# Altium project 数字时钟v2.PrjPcb
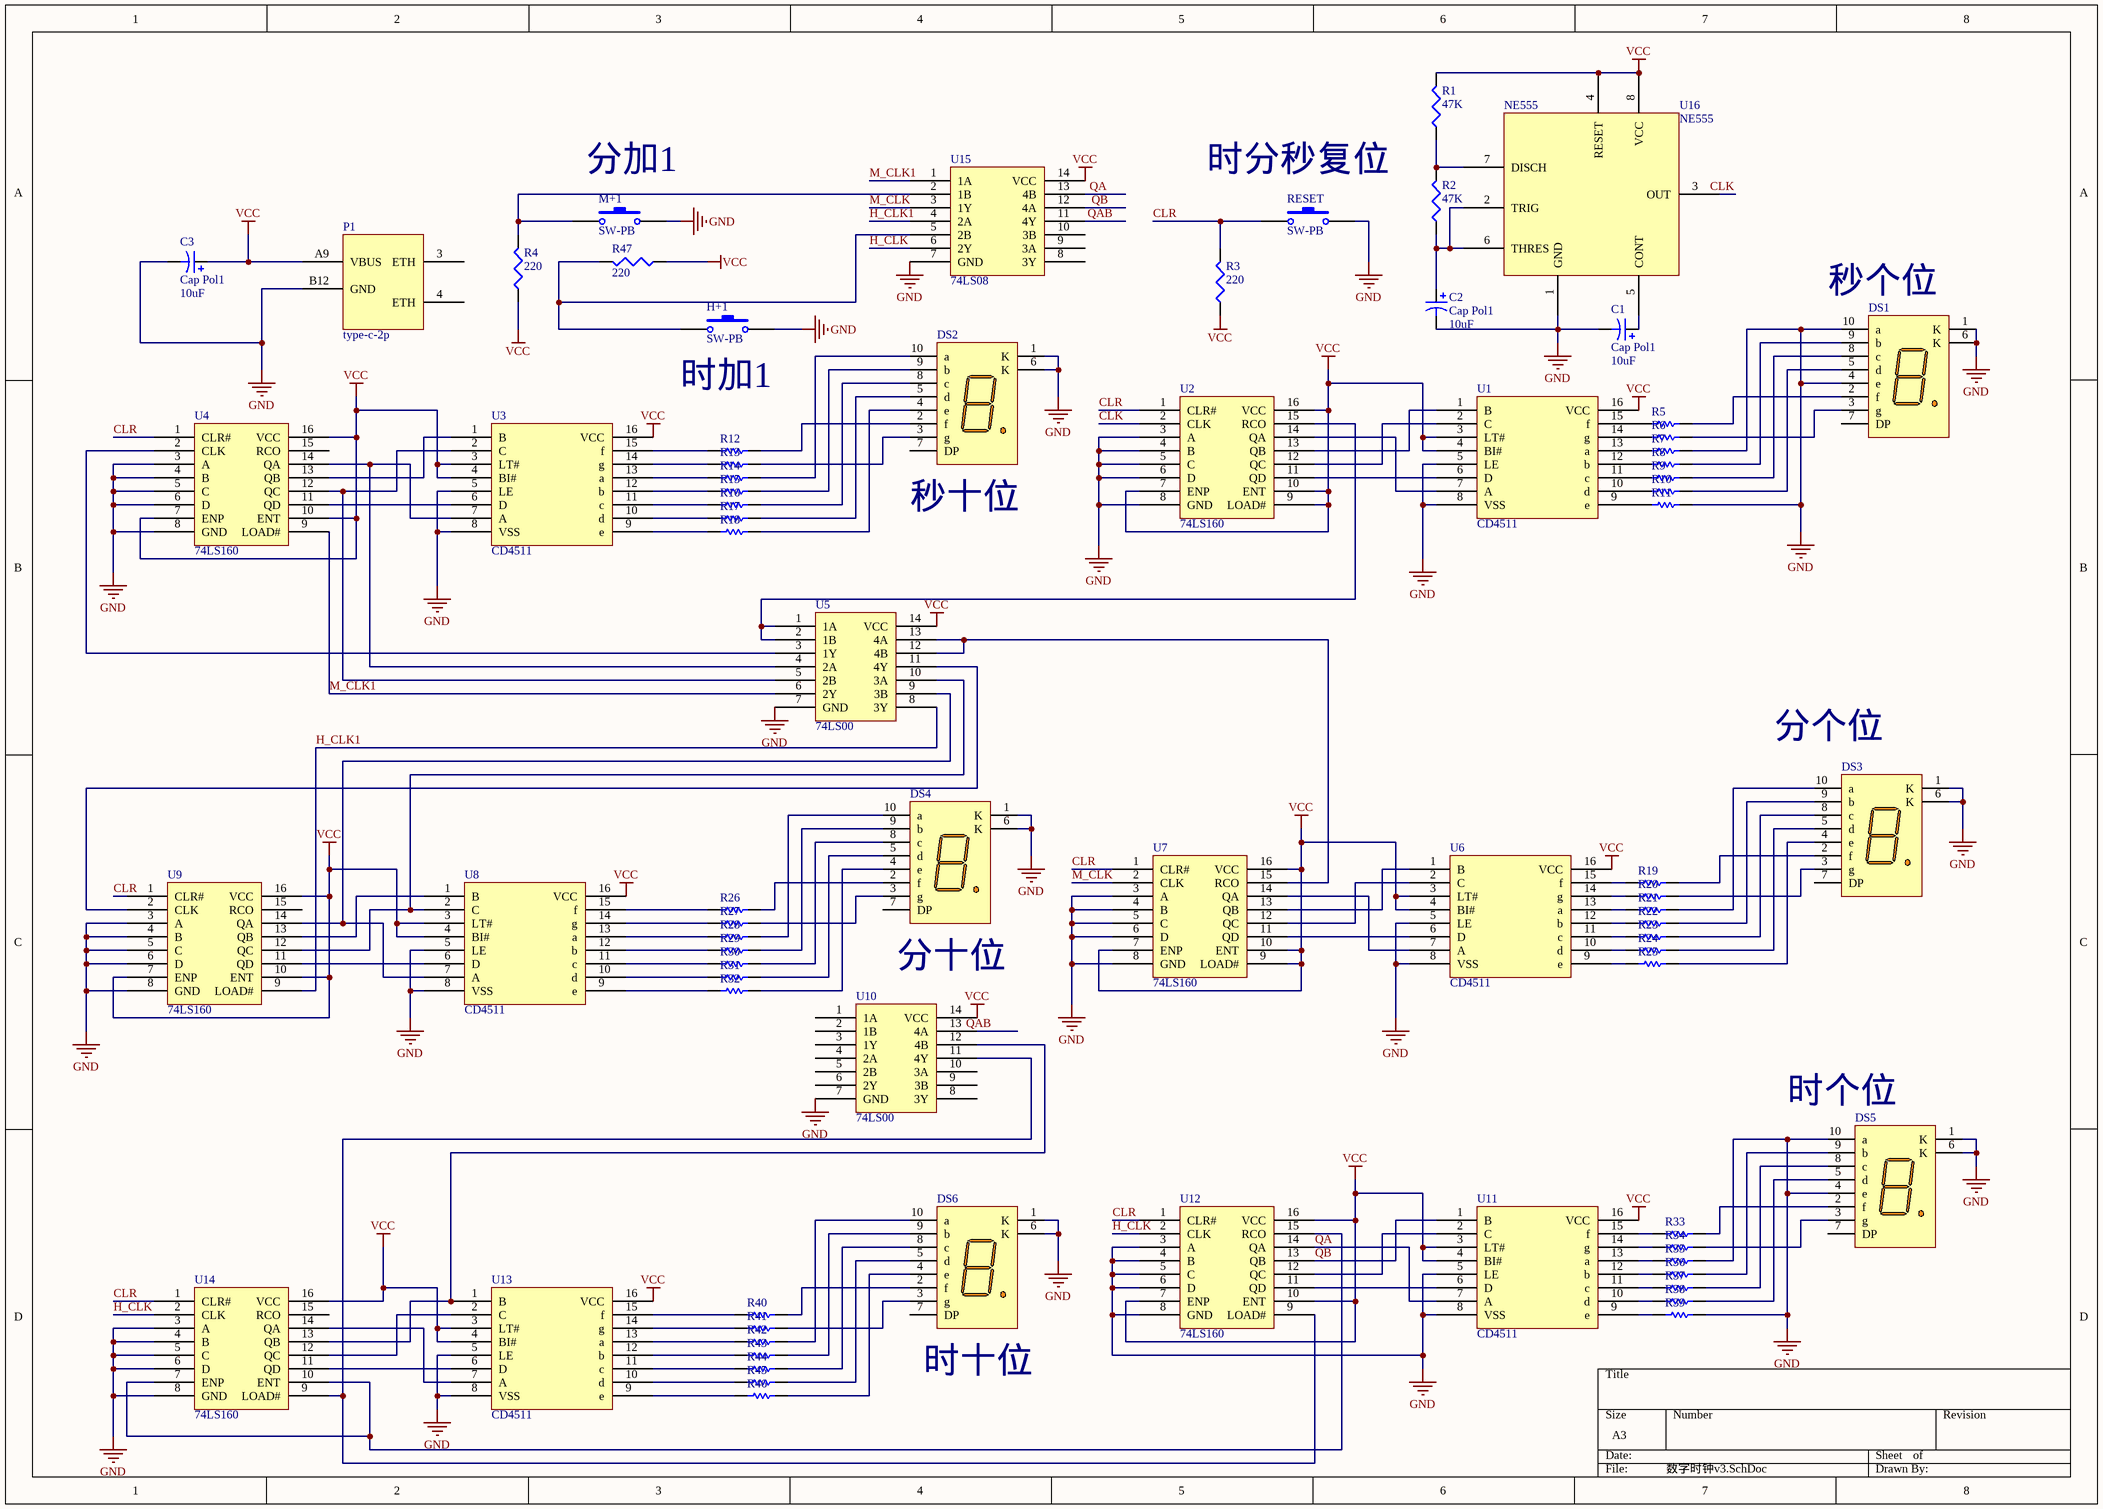
[diagram p0: 数字时钟v3.SchDoc]
1 sheet, 76 parts. Net scope: global (net labels, ports and power ports of the same name join across sheets).
Board file: 数字时钟v3.PcbDoc

## Sheet 数字时钟v3.SchDoc: 数字电路时钟
size A3; DrawnBy: zhanweiming

### Parts
C1  Cap Pol1  value 10uF  [电容]
C2  Cap Pol1  value 10uF  [电容]
C3  Cap Pol1  value 10uF  [电容]
DS1  Dpy Amber-CC  [A]  (value not drawn)
DS2  Dpy Amber-CC  [A]  (value not drawn)
DS3  Dpy Amber-CC  [A]  (value not drawn)
DS4  Dpy Amber-CC  [A]  (value not drawn)
DS5  Dpy Amber-CC  [A]  (value not drawn)
DS6  Dpy Amber-CC  [A]  (value not drawn)
H+1  SW-PB  [按键]
M+1  SW-PB  [按键]
P1  type-c-2p  [type-c-2p]
R1  value 47K  [AXIAL-0.3]  (hidden comment: Res3)
R2  value 47K  [AXIAL-0.3]  (hidden comment: Res3)
R3  value 220  [AXIAL-0.3]  (hidden comment: Res3)
R4  value 220  [AXIAL-0.3]  (hidden comment: Res3)
R5  Res1  [AXIAL-0.3]  (value not drawn)
R6  Res1  [AXIAL-0.3]  (value not drawn)
R7  Res1  [AXIAL-0.3]  (value not drawn)
R8  Res1  [AXIAL-0.3]  (value not drawn)
R9  Res1  [AXIAL-0.3]  (value not drawn)
R10  Res1  [AXIAL-0.3]  (value not drawn)
R11  Res1  [AXIAL-0.3]  (value not drawn)
R12  Res1  [AXIAL-0.3]  (value not drawn)
R13  Res1  [AXIAL-0.3]  (value not drawn)
R14  Res1  [AXIAL-0.3]  (value not drawn)
R15  Res1  [AXIAL-0.3]  (value not drawn)
R16  Res1  [AXIAL-0.3]  (value not drawn)
R17  Res1  [AXIAL-0.3]  (value not drawn)
R18  Res1  [AXIAL-0.3]  (value not drawn)
R19  Res1  [AXIAL-0.3]  (value not drawn)
R20  Res1  [AXIAL-0.3]  (value not drawn)
R21  Res1  [AXIAL-0.3]  (value not drawn)
R22  Res1  [AXIAL-0.3]  (value not drawn)
R23  Res1  [AXIAL-0.3]  (value not drawn)
R24  Res1  [AXIAL-0.3]  (value not drawn)
R25  Res1  [AXIAL-0.3]  (value not drawn)
R26  Res1  [AXIAL-0.3]  (value not drawn)
R27  Res1  [AXIAL-0.3]  (value not drawn)
R28  Res1  [AXIAL-0.3]  (value not drawn)
R29  Res1  [AXIAL-0.3]  (value not drawn)
R30  Res1  [AXIAL-0.3]  (value not drawn)
R31  Res1  [AXIAL-0.3]  (value not drawn)
R32  Res1  [AXIAL-0.3]  (value not drawn)
R33  Res1  [AXIAL-0.3]  (value not drawn)
R34  Res1  [AXIAL-0.3]  (value not drawn)
R35  Res1  [AXIAL-0.3]  (value not drawn)
R36  Res1  [AXIAL-0.3]  (value not drawn)
R37  Res1  [AXIAL-0.3]  (value not drawn)
R38  Res1  [AXIAL-0.3]  (value not drawn)
R39  Res1  [AXIAL-0.3]  (value not drawn)
R40  Res1  [AXIAL-0.3]  (value not drawn)
R41  Res1  [AXIAL-0.3]  (value not drawn)
R42  Res1  [AXIAL-0.3]  (value not drawn)
R43  Res1  [AXIAL-0.3]  (value not drawn)
R44  Res1  [AXIAL-0.3]  (value not drawn)
R45  Res1  [AXIAL-0.3]  (value not drawn)
R46  Res1  [AXIAL-0.3]  (value not drawn)
R47  value 220  [AXIAL-0.3]  (hidden comment: Res3)
RESET  SW-PB  [按键]
U1  CD4511  [CD4511BM/TR]
U2  74LS160  [DIP-16]
U3  CD4511  [CD4511BM/TR]
U4  74LS160  [DIP-16]
U5  74LS00  [DIP-14]
U6  CD4511  [CD4511BM/TR]
U7  74LS160  [DIP-16]
U8  CD4511  [CD4511BM/TR]
U9  74LS160  [DIP-16]
U10  74LS00  [DIP-14]
U11  CD4511  [CD4511BM/TR]
U12  74LS160  [DIP-16]
U13  CD4511  [CD4511BM/TR]
U14  74LS160  [DIP-16]
U15  74LS08  [DIP-14]
U16  NE555  [DIP-8]

### Nets
GND: C1.2 C2.2 C3.2 DS1.1(K) DS1.4(e) DS1.6(K) DS1.10(a) DS2.1(K) DS2.6(K) DS3.1(K) DS3.6(K) DS4.1(K) DS4.6(K) DS5.1(K) DS5.4(e) DS5.6(K) DS5.10(a) DS6.1(K) DS6.6(K) H+1.2 M+1.2 P1.B12(GND) R7.2 R11.2 R35.2 R39.2 RESET.2 U1.5(LE) U1.8(VSS) U2.3(A) U2.4(B) U2.5(C) U2.6(D) U2.8(GND) U3.5(LE) U3.8(VSS) U4.3(A) U4.4(B) U4.5(C) U4.6(D) U4.8(GND) U5.7(GND) U6.5(LE) U6.8(VSS) U7.3(A) U7.4(B) U7.5(C) U7.6(D) U7.8(GND) U8.5(LE) U8.8(VSS) U9.3(A) U9.4(B) U9.5(C) U9.6(D) U9.8(GND) U10.7(GND) U11.5(LE) U11.8(VSS) U12.3(A) U12.4(B) U12.5(C) U12.6(D) U12.8(GND) U13.5(LE) U13.8(VSS) U14.3(A) U14.4(B) U14.5(C) U14.6(D) U14.8(GND) U15.7(GND) U16.1(GND)
VCC: C3.1 P1.A9(VBUS) R1.2 R3.1 R4.1 R47.1 U1.3(LT#) U1.4(BI#) U1.16(VCC) U2.7(ENP) U2.9(LOAD#) U2.10(ENT) U2.16(VCC) U3.3(LT#) U3.4(BI#) U3.16(VCC) U4.7(ENP) U4.10(ENT) U4.16(VCC) U5.14(VCC) U6.3(LT#) U6.4(BI#) U6.16(VCC) U7.7(ENP) U7.9(LOAD#) U7.10(ENT) U7.16(VCC) U8.3(LT#) U8.4(BI#) U8.16(VCC) U9.7(ENP) U9.10(ENT) U9.16(VCC) U10.14(VCC) U11.3(LT#) U11.4(BI#) U11.16(VCC) U12.7(ENP) U12.10(ENT) U12.16(VCC) U13.3(LT#) U13.4(BI#) U13.16(VCC) U14.16(VCC) U15.14(VCC) U16.4(RESET) U16.8(VCC)
CLK: U2.2(CLK) U16.3(OUT)
CLR: R3.2 RESET.1 U2.1(CLR#) U4.1(CLR#) U7.1(CLR#) U9.1(CLR#) U12.1(CLR#) U14.1(CLR#)
H_CLK: U12.2(CLK) U14.2(CLK) U15.6(2Y)
H_CLK1: U5.8(3Y) U9.9(LOAD#) U15.4(2A)
M_CLK: U7.2(CLK) U15.3(1Y)
M_CLK1: U4.9(LOAD#) U5.6(2Y) U15.1(1A)
QA: U11.7(A) U12.14(QA) U15.13(4B)
QAB: U10.13(4A) U15.11(4Y)
QB: U11.1(B) U12.13(QB) U15.12(4A)
NetC1_1: C1.1 U16.5(CONT)
NetC2_1: C2.1 R2.1 U16.2(TRIG) U16.6(THRES)
NetDS1_2: DS1.2(f) R5.2
NetDS1_3: DS1.3(g) R6.2
NetDS1_5: DS1.5(d) R10.2
NetDS1_8: DS1.8(c) R9.2
NetDS1_9: DS1.9(b) R8.2
NetDS2_2: DS2.2(f) R12.2
NetDS2_3: DS2.3(g) R13.2
NetDS2_4: DS2.4(e) R18.2
NetDS2_5: DS2.5(d) R17.2
NetDS2_8: DS2.8(c) R16.2
NetDS2_9: DS2.9(b) R15.2
NetDS2_10: DS2.10(a) R14.2
NetDS3_2: DS3.2(f) R19.2
NetDS3_3: DS3.3(g) R20.2
NetDS3_4: DS3.4(e) R25.2
NetDS3_5: DS3.5(d) R24.2
NetDS3_8: DS3.8(c) R23.2
NetDS3_9: DS3.9(b) R22.2
NetDS3_10: DS3.10(a) R21.2
NetDS4_2: DS4.2(f) R26.2
NetDS4_3: DS4.3(g) R27.2
NetDS4_4: DS4.4(e) R32.2
NetDS4_5: DS4.5(d) R31.2
NetDS4_8: DS4.8(c) R30.2
NetDS4_9: DS4.9(b) R29.2
NetDS4_10: DS4.10(a) R28.2
NetDS5_2: DS5.2(f) R33.2
NetDS5_3: DS5.3(g) R34.2
NetDS5_5: DS5.5(d) R38.2
NetDS5_8: DS5.8(c) R37.2
NetDS5_9: DS5.9(b) R36.2
NetDS6_2: DS6.2(f) R40.2
NetDS6_3: DS6.3(g) R41.2
NetDS6_4: DS6.4(e) R46.2
NetDS6_5: DS6.5(d) R45.2
NetDS6_8: DS6.8(c) R44.2
NetDS6_9: DS6.9(b) R43.2
NetDS6_10: DS6.10(a) R42.2
NetH+1_1: H+1.1 R47.2 U15.5(2B)
NetM+1_1: M+1.1 R4.2 U15.2(1B)
NetR1_1: R1.1 R2.2 U16.7(DISCH)
NetR5_1: R5.1 U1.15(f)
NetR6_1: R6.1 U1.14(g)
NetR7_1: R7.1 U1.13(a)
NetR8_1: R8.1 U1.12(b)
NetR9_1: R9.1 U1.11(c)
NetR10_1: R10.1 U1.10(d)
NetR11_1: R11.1 U1.9(e)
NetR12_1: R12.1 U3.15(f)
NetR13_1: R13.1 U3.14(g)
NetR14_1: R14.1 U3.13(a)
NetR15_1: R15.1 U3.12(b)
NetR16_1: R16.1 U3.11(c)
NetR17_1: R17.1 U3.10(d)
NetR18_1: R18.1 U3.9(e)
NetR19_1: R19.1 U6.15(f)
NetR20_1: R20.1 U6.14(g)
NetR21_1: R21.1 U6.13(a)
NetR22_1: R22.1 U6.12(b)
NetR23_1: R23.1 U6.11(c)
NetR24_1: R24.1 U6.10(d)
NetR25_1: R25.1 U6.9(e)
NetR26_1: R26.1 U8.15(f)
NetR27_1: R27.1 U8.14(g)
NetR28_1: R28.1 U8.13(a)
NetR29_1: R29.1 U8.12(b)
NetR30_1: R30.1 U8.11(c)
NetR31_1: R31.1 U8.10(d)
NetR32_1: R32.1 U8.9(e)
NetR33_1: R33.1 U11.15(f)
NetR34_1: R34.1 U11.14(g)
NetR35_1: R35.1 U11.13(a)
NetR36_1: R36.1 U11.12(b)
NetR37_1: R37.1 U11.11(c)
NetR38_1: R38.1 U11.10(d)
NetR39_1: R39.1 U11.9(e)
NetR40_1: R40.1 U13.15(f)
NetR41_1: R41.1 U13.14(g)
NetR42_1: R42.1 U13.13(a)
NetR43_1: R43.1 U13.12(b)
NetR44_1: R44.1 U13.11(c)
NetR45_1: R45.1 U13.10(d)
NetR46_1: R46.1 U13.9(e)
NetU1_1: U1.1(B) U2.13(QB)
NetU1_2: U1.2(C) U2.12(QC)
NetU1_6: U1.6(D) U2.11(QD)
NetU1_7: U1.7(A) U2.14(QA)
NetU2_15: U2.15(RCO) U5.1(1A) U5.2(1B)
NetU3_1: U3.1(B) U4.13(QB)
NetU3_2: U3.2(C) U4.12(QC) U5.5(2B)
NetU3_6: U3.6(D) U4.11(QD)
NetU3_7: U3.7(A) U4.14(QA) U5.4(2A)
NetU4_2: U4.2(CLK) U5.3(1Y)
NetU5_9: U5.9(3B) U8.7(A) U9.14(QA)
NetU5_10: U5.10(3A) U8.2(C) U9.12(QC)
NetU5_11: U5.11(4Y) U9.2(CLK)
NetU5_12: U5.12(4B) U5.13(4A) U7.15(RCO)
NetU6_1: U6.1(B) U7.13(QB)
NetU6_2: U6.2(C) U7.12(QC)
NetU6_6: U6.6(D) U7.11(QD)
NetU6_7: U6.7(A) U7.14(QA)
NetU8_1: U8.1(B) U9.13(QB)
NetU8_6: U8.6(D) U9.11(QD)
NetU10_11: U10.11(4Y) U12.9(LOAD#) U14.9(LOAD#)
NetU10_12: U10.12(4B) U13.1(B) U14.13(QB)
NetU11_2: U11.2(C) U12.12(QC)
NetU11_6: U11.6(D) U12.11(QD)
NetU12_15: U12.15(RCO) U14.7(ENP) U14.10(ENT)
NetU13_2: U13.2(C) U14.12(QC)
NetU13_6: U13.6(D) U14.11(QD)
NetU13_7: U13.7(A) U14.14(QA)

Not connected (* = marked no-connect by the designer): DS1 7(DP); DS2 7(DP); DS3 7(DP); DS4 7(DP); DS5 7(DP); DS6 7(DP); P1 3(ETH) 4(ETH); U4 15(RCO); U9 15(RCO); U10 1(1A) 2(1B) 3(1Y) 4(2A) 5(2B) 6(2Y) 8(3Y) 9(3B) 10(3A); U14 15(RCO); U15 8(3Y) 9(3A) 10(3B)

### Notes on the sheet
- (near M+1) 分加1
- (near RESET) 时分秒复位
- (near DS1) 秒个位
- (near H+1) 时加1
- (near DS2) 秒十位
- (near DS3) 分个位
- 分十位
- (near DS5) 时个位
- (near DS6) 时十位

### Library data of the parts
C1-C3 = Cap Pol1: Polarized Capacitor (Radial); Published: 8-Jun-2000; LatestRevisionDate: 17-Jul-2002; LatestRevisionNote: Re-released for DXP Platform.; PackageReference: RB7.6-15; Publisher: Altium Limited; PackageDescription: Polarized Capacitor (Radial); 2 Leads
DS1-DS6 = Dpy Amber-CC: 7.62 mm Black Surface Orange 7-Segment Display: CC, RH DP; MinimumIntensity: 354 ucd; Note: Pins 1 and 6 are redundant Cathodes.; Published: 8-Jun-2000; LatestRevisionDate: 17-Dec-2003; LatestRevisionNote: Schematic revised, PCB Footprint replaced.; DatasheetVersion: 19-Feb-2002; PackageVersion: 11-Feb-2002; PackageReference: A; Publisher: Altium Limited; PackageDescription: LED, 7-Segment Display, 7.62 mm, RHD; 10 Leads; Row Space 5.08 mm; Pitch 2.54 mm; Colour: Orange; ComponentLink1Description: Manufacturer Link; ComponentLink1URL: http://www.agilent.com/
H+1 M+1 RESET = SW-PB: Switch; Published: 24-Mar-1999; LatestRevisionDate: 17-Jul-2002; LatestRevisionNote: Re-released for DXP Platform.; PackageReference: SPST-2; Publisher: Altium Limited; PackageDescription: Switch; 2 Leads
R1-R4 R47 = Res3: Resistor; Published: 8-Jun-2000; LatestRevisionDate: 29-May-2009; LatestRevisionNote: IPC-7351 Footprint Added.; PackageReference: J1-0603; Publisher: Altium Limited; PackageDescription: Chip Resistor
R5-R46 = Res1: Resistor; Value: 1K; Published: 8-Jun-2000; LatestRevisionDate: 17-Jul-2002; LatestRevisionNote: Re-released for DXP Platform.; PackageReference: AXIAL-0.3; Publisher: Altium Limited; PackageDescription: Axial Device, Thru-Hole; 2 Leads; 0.3 in Pin Spacing